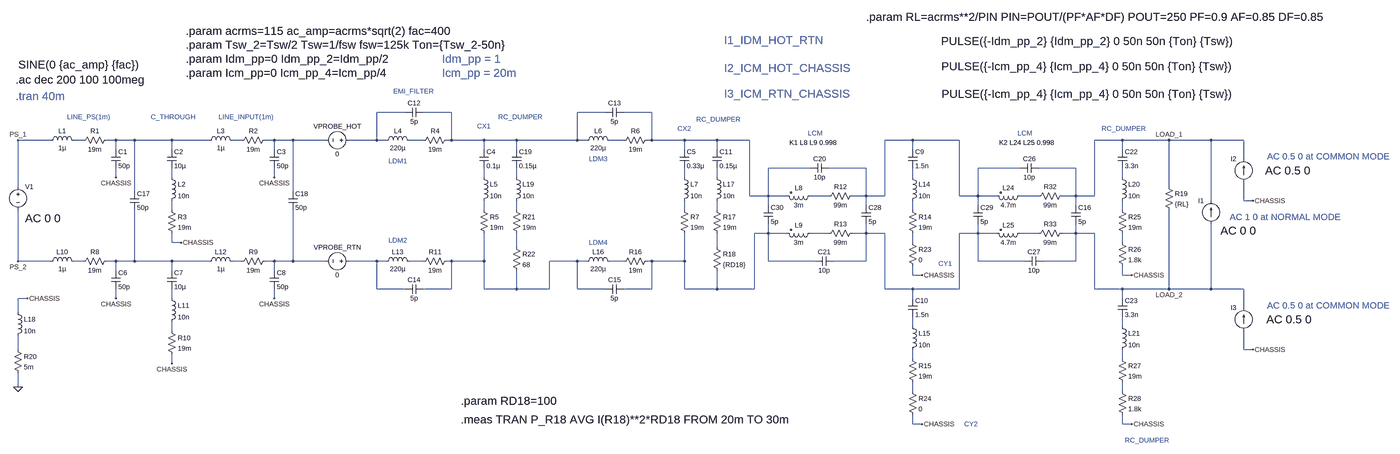
[diagram p0: schematic 461C_FILTER_20260719.asc, whole sheet]
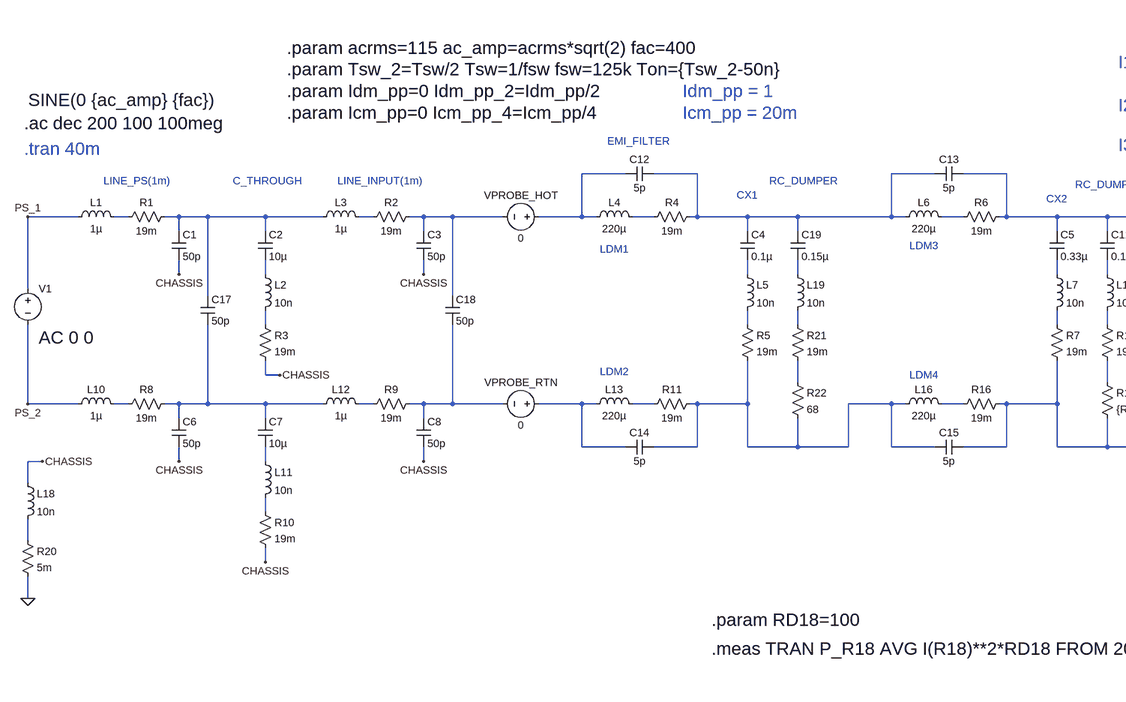
[diagram p1: schematic 461C_FILTER_20260719.asc, part, row 1 of 1, column 1 of 2]
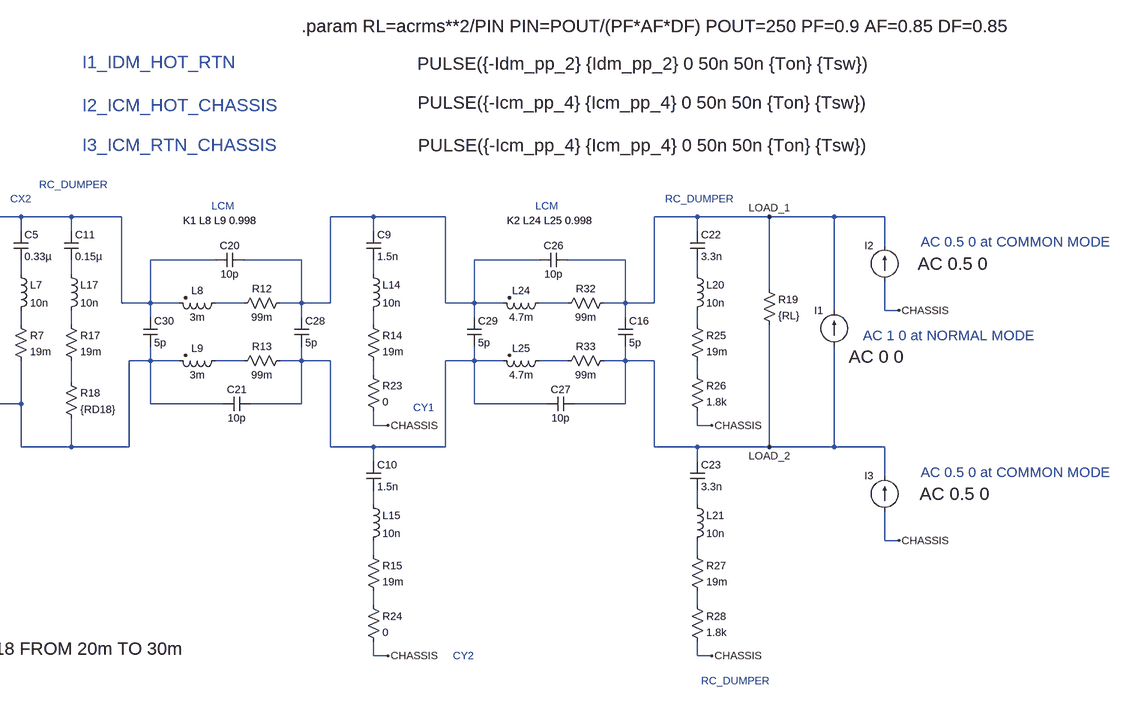
[diagram p2: schematic 461C_FILTER_20260719.asc, part, row 1 of 1, column 2 of 2]
461C_FILTER_20260719.asc, the LTspice schematic file:
Version 4.1
SHEET 1 4516 1364
WIRE 704 -48 608 -48
WIRE 864 -48 768 -48
WIRE 1392 -48 1296 -48
WIRE 1552 -48 1456 -48
WIRE -512 48 -624 48
WIRE -400 48 -432 48
WIRE -288 48 -320 48
WIRE -224 48 -288 48
WIRE -96 48 -224 48
WIRE 32 48 -96 48
WIRE 144 48 112 48
WIRE 256 48 224 48
WIRE 320 48 256 48
WIRE 432 48 320 48
WIRE 608 48 608 -48
WIRE 608 48 512 48
WIRE 640 48 608 48
WIRE 768 48 720 48
WIRE 864 48 864 -48
WIRE 864 48 848 48
WIRE 976 48 864 48
WIRE 1088 48 976 48
WIRE 1296 48 1296 -48
WIRE 1296 48 1088 48
WIRE 1328 48 1296 48
WIRE 1456 48 1408 48
WIRE 1552 48 1552 -48
WIRE 1552 48 1536 48
WIRE 1664 48 1552 48
WIRE 1776 48 1664 48
WIRE 1888 48 1776 48
WIRE 2448 48 2352 48
WIRE 2608 48 2448 48
WIRE 3168 48 3072 48
WIRE 3328 48 3168 48
WIRE 3472 48 3328 48
WIRE 3584 48 3472 48
WIRE -288 80 -288 48
WIRE -96 80 -96 48
WIRE 256 80 256 48
WIRE 976 80 976 48
WIRE 1088 80 1088 48
WIRE 1664 80 1664 48
WIRE 1776 80 1776 48
WIRE 2448 80 2448 48
WIRE 3168 80 3168 48
WIRE 3584 112 3584 48
WIRE 2096 144 1952 144
WIRE 2288 144 2160 144
WIRE 2816 144 2672 144
WIRE 3008 144 2880 144
WIRE -288 176 -288 144
WIRE -96 176 -96 144
WIRE 256 176 256 144
WIRE 976 176 976 144
WIRE 1088 176 1088 144
WIRE 1664 176 1664 144
WIRE 1776 176 1776 144
WIRE 2448 176 2448 144
WIRE 3168 176 3168 144
WIRE -624 208 -624 48
WIRE 3328 208 3328 48
WIRE -224 224 -224 48
WIRE 320 224 320 48
WIRE 1888 240 1888 48
WIRE 1952 240 1952 144
WIRE 1952 240 1888 240
WIRE 2016 240 1952 240
WIRE 2160 240 2096 240
WIRE 2288 240 2288 144
WIRE 2288 240 2240 240
WIRE 2352 240 2352 48
WIRE 2352 240 2288 240
WIRE 2608 240 2608 48
WIRE 2672 240 2672 144
WIRE 2672 240 2608 240
WIRE 2736 240 2672 240
WIRE 2880 240 2816 240
WIRE 3008 240 3008 144
WIRE 3008 240 2960 240
WIRE 3072 240 3072 48
WIRE 3072 240 3008 240
WIRE 3472 256 3472 48
WIRE 3584 256 3584 192
WIRE 3616 256 3584 256
WIRE 1952 272 1952 240
WIRE 2288 272 2288 240
WIRE 2672 272 2672 240
WIRE 3008 272 3008 240
WIRE -96 288 -96 256
WIRE 976 288 976 256
WIRE 1088 288 1088 256
WIRE 1664 288 1664 256
WIRE 1776 288 1776 256
WIRE 2448 288 2448 256
WIRE 3168 288 3168 256
WIRE 1952 368 1952 336
WIRE 1952 368 1904 368
WIRE 2016 368 1952 368
WIRE 2160 368 2096 368
WIRE 2288 368 2288 336
WIRE 2288 368 2240 368
WIRE 2352 368 2288 368
WIRE 2672 368 2672 336
WIRE 2672 368 2608 368
WIRE 2736 368 2672 368
WIRE 2880 368 2816 368
WIRE 3008 368 3008 336
WIRE 3008 368 2960 368
WIRE 3072 368 3008 368
WIRE -96 400 -96 368
WIRE -64 400 -96 400
WIRE 2448 400 2448 368
WIRE 3168 400 3168 368
WIRE 1088 416 1088 368
WIRE 1776 416 1776 368
WIRE -624 464 -624 288
WIRE -512 464 -624 464
WIRE -400 464 -432 464
WIRE -288 464 -320 464
WIRE -224 464 -224 288
WIRE -224 464 -288 464
WIRE -96 464 -224 464
WIRE 32 464 -96 464
WIRE 144 464 112 464
WIRE 256 464 224 464
WIRE 320 464 320 288
WIRE 320 464 256 464
WIRE 432 464 320 464
WIRE 608 464 512 464
WIRE 640 464 608 464
WIRE 768 464 720 464
WIRE 864 464 848 464
WIRE 976 464 976 368
WIRE 976 464 864 464
WIRE 1296 464 1200 464
WIRE 1328 464 1296 464
WIRE 1456 464 1408 464
WIRE 1552 464 1536 464
WIRE 1664 464 1664 368
WIRE 1664 464 1552 464
WIRE 1952 464 1952 368
WIRE 2112 464 1952 464
WIRE 2288 464 2288 368
WIRE 2288 464 2176 464
WIRE 2672 464 2672 368
WIRE 2832 464 2672 464
WIRE 3008 464 3008 368
WIRE 3008 464 2896 464
WIRE -288 496 -288 464
WIRE -96 496 -96 464
WIRE 256 496 256 464
WIRE 2448 512 2448 480
WIRE 2480 512 2448 512
WIRE 3168 512 3168 480
WIRE 3200 512 3168 512
WIRE 608 560 608 464
WIRE 704 560 608 560
WIRE 864 560 864 464
WIRE 864 560 768 560
WIRE 976 560 976 464
WIRE 1088 560 1088 496
WIRE 1088 560 976 560
WIRE 1200 560 1200 464
WIRE 1200 560 1088 560
WIRE 1296 560 1296 464
WIRE 1392 560 1296 560
WIRE 1552 560 1552 464
WIRE 1552 560 1456 560
WIRE 1664 560 1664 464
WIRE 1776 560 1776 496
WIRE 1776 560 1664 560
WIRE 1904 560 1904 368
WIRE 1904 560 1776 560
WIRE 2352 560 2352 368
WIRE 2448 560 2352 560
WIRE 2608 560 2608 368
WIRE 2608 560 2448 560
WIRE 3072 560 3072 368
WIRE 3168 560 3072 560
WIRE 3328 560 3328 288
WIRE 3328 560 3168 560
WIRE 3472 560 3472 336
WIRE 3472 560 3328 560
WIRE 3584 560 3472 560
WIRE -592 592 -624 592
WIRE -288 592 -288 560
WIRE -96 592 -96 560
WIRE 256 592 256 560
WIRE 2448 592 2448 560
WIRE 3168 592 3168 560
WIRE 3584 624 3584 560
WIRE -624 640 -624 592
WIRE 2448 688 2448 656
WIRE 3168 688 3168 656
WIRE -96 704 -96 672
WIRE -624 768 -624 720
WIRE 3584 768 3584 704
WIRE 3616 768 3584 768
WIRE 2448 800 2448 768
WIRE 3168 800 3168 768
WIRE -96 816 -96 784
WIRE -624 896 -624 848
WIRE 2448 912 2448 880
WIRE 3168 912 3168 880
WIRE 2448 1024 2448 992
WIRE 2480 1024 2448 1024
WIRE 3168 1024 3168 992
WIRE 3200 1024 3168 1024
FLAG 3328 48 LOAD_1
FLAG 3328 560 LOAD_2
FLAG -624 48 PS_1
FLAG -624 464 PS_2
FLAG -288 176 CHASSIS
FLAG -288 592 CHASSIS
FLAG -96 816 CHASSIS
FLAG 256 176 CHASSIS
FLAG 256 592 CHASSIS
FLAG -64 400 CHASSIS
FLAG 2480 512 CHASSIS
FLAG -624 896 0
FLAG -592 592 CHASSIS
FLAG 3616 256 CHASSIS
FLAG 3616 768 CHASSIS
FLAG 2480 1024 CHASSIS
FLAG 3200 512 CHASSIS
FLAG 3200 1024 CHASSIS
SYMBOL voltage -624 192 R0
WINDOW 123 24 124 Left 4
WINDOW 39 0 0 Left 0
WINDOW 3 1 -404 Left 4
SYMATTR Value2 AC 0 0
SYMATTR Value SINE(0 {ac_amp} {fac})
SYMATTR InstName V1
SYMBOL ind -528 64 R270
WINDOW 0 32 56 VTop 2
WINDOW 3 5 56 VBottom 2
SYMATTR InstName L1
SYMATTR Value 1µ
SYMATTR SpiceLine Rser=1m
SYMBOL res -304 32 R90
WINDOW 0 0 56 VBottom 2
WINDOW 3 32 56 VTop 2
SYMATTR InstName R1
SYMATTR Value 19m
SYMBOL cap -304 80 R0
SYMATTR InstName C1
SYMATTR Value 50p
SYMBOL cap -112 80 R0
SYMATTR InstName C2
SYMATTR Value 10µ
SYMBOL ind -112 160 R0
SYMATTR InstName L2
SYMATTR Value 10n
SYMATTR SpiceLine Rser=1m
SYMBOL ind 16 64 R270
WINDOW 0 32 56 VTop 2
WINDOW 3 5 56 VBottom 2
SYMATTR InstName L3
SYMATTR Value 1µ
SYMATTR SpiceLine Rser=1m
SYMBOL res 240 32 R90
WINDOW 0 0 56 VBottom 2
WINDOW 3 32 56 VTop 2
SYMATTR InstName R2
SYMATTR Value 19m
SYMBOL cap 240 80 R0
SYMATTR InstName C3
SYMATTR Value 50p
SYMBOL res -112 272 R0
SYMATTR InstName R3
SYMATTR Value 19m
SYMBOL ind 624 64 R270
WINDOW 0 32 56 VTop 2
WINDOW 3 5 56 VBottom 2
SYMATTR InstName L4
SYMATTR Value 220µ
SYMATTR SpiceLine Rser=1m
SYMBOL res 864 32 R90
WINDOW 0 0 56 VBottom 2
WINDOW 3 32 56 VTop 2
SYMATTR InstName R4
SYMATTR Value 19m
SYMBOL cap 960 80 R0
SYMATTR InstName C4
SYMATTR Value 0.1µ
SYMBOL ind 960 160 R0
SYMATTR InstName L5
SYMATTR Value 10n
SYMATTR SpiceLine Rser=1m
SYMBOL res 960 272 R0
SYMATTR InstName R5
SYMATTR Value 19m
SYMBOL ind 1312 64 R270
WINDOW 0 32 56 VTop 2
WINDOW 3 5 56 VBottom 2
SYMATTR InstName L6
SYMATTR Value 220µ
SYMATTR SpiceLine Rser=1m
SYMBOL res 1552 32 R90
WINDOW 0 0 56 VBottom 2
WINDOW 3 32 56 VTop 2
SYMATTR InstName R6
SYMATTR Value 19m
SYMBOL cap 1648 80 R0
SYMATTR InstName C5
SYMATTR Value 0.33µ
SYMBOL ind 1648 160 R0
SYMATTR InstName L7
SYMATTR Value 10n
SYMATTR SpiceLine Rser=1m
SYMBOL res 1648 272 R0
SYMATTR InstName R7
SYMATTR Value 19m
SYMBOL ind2 2112 224 R90
WINDOW 0 4 56 VBottom 2
WINDOW 3 32 56 VTop 2
SYMATTR InstName L8
SYMATTR Value 3m
SYMATTR SpiceLine Rser=1m
SYMBOL ind2 2112 352 R90
WINDOW 0 4 56 VBottom 2
WINDOW 3 32 56 VTop 2
SYMATTR InstName L9
SYMATTR Value 3m
SYMATTR SpiceLine Rser=1m
SYMBOL ind -528 480 R270
WINDOW 0 32 56 VTop 2
WINDOW 3 5 56 VBottom 2
SYMATTR InstName L10
SYMATTR Value 1µ
SYMATTR SpiceLine Rser=1m
SYMBOL res -304 448 R90
WINDOW 0 0 56 VBottom 2
WINDOW 3 32 56 VTop 2
SYMATTR InstName R8
SYMATTR Value 19m
SYMBOL cap -304 496 R0
SYMATTR InstName C6
SYMATTR Value 50p
SYMBOL cap -112 496 R0
SYMATTR InstName C7
SYMATTR Value 10µ
SYMBOL ind -112 576 R0
SYMATTR InstName L11
SYMATTR Value 10n
SYMATTR SpiceLine Rser=1m
SYMBOL ind 16 480 R270
WINDOW 0 32 56 VTop 2
WINDOW 3 5 56 VBottom 2
SYMATTR InstName L12
SYMATTR Value 1µ
SYMATTR SpiceLine Rser=1m
SYMBOL res 240 448 R90
WINDOW 0 0 56 VBottom 2
WINDOW 3 32 56 VTop 2
SYMATTR InstName R9
SYMATTR Value 19m
SYMBOL cap 240 496 R0
SYMATTR InstName C8
SYMATTR Value 50p
SYMBOL res -112 688 R0
SYMATTR InstName R10
SYMATTR Value 19m
SYMBOL ind 624 480 R270
WINDOW 0 32 56 VTop 2
WINDOW 3 5 56 VBottom 2
SYMATTR InstName L13
SYMATTR Value 220µ
SYMATTR SpiceLine Rser=1m
SYMBOL res 864 448 R90
WINDOW 0 0 56 VBottom 2
WINDOW 3 32 56 VTop 2
SYMATTR InstName R11
SYMATTR Value 19m
SYMBOL res 2256 224 R90
WINDOW 0 0 56 VBottom 2
WINDOW 3 32 56 VTop 2
SYMATTR InstName R12
SYMATTR Value 99m
SYMBOL res 2256 352 R90
WINDOW 0 0 56 VBottom 2
WINDOW 3 32 56 VTop 2
SYMATTR InstName R13
SYMATTR Value 99m
SYMBOL cap 2432 80 R0
SYMATTR InstName C9
SYMATTR Value 1.5n
SYMBOL ind 2432 160 R0
SYMATTR InstName L14
SYMATTR Value 10n
SYMATTR SpiceLine Rser=1m
SYMBOL res 2432 272 R0
SYMATTR InstName R14
SYMATTR Value 19m
SYMBOL cap 2432 592 R0
SYMATTR InstName C10
SYMATTR Value 1.5n
SYMBOL ind 2432 672 R0
SYMATTR InstName L15
SYMATTR Value 10n
SYMATTR SpiceLine Rser=1m
SYMBOL res 2432 784 R0
SYMATTR InstName R15
SYMATTR Value 19m
SYMBOL ind 1312 480 R270
WINDOW 0 32 56 VTop 2
WINDOW 3 5 56 VBottom 2
SYMATTR InstName L16
SYMATTR Value 220µ
SYMATTR SpiceLine Rser=1m
SYMBOL res 1552 448 R90
WINDOW 0 0 56 VBottom 2
WINDOW 3 32 56 VTop 2
SYMATTR InstName R16
SYMATTR Value 19m
SYMBOL cap 1760 80 R0
SYMATTR InstName C11
SYMATTR Value 0.15µ
SYMBOL ind 1760 160 R0
SYMATTR InstName L17
SYMATTR Value 10n
SYMATTR SpiceLine Rser=1m
SYMBOL res 1760 272 R0
SYMATTR InstName R17
SYMATTR Value 19m
SYMBOL res 1760 400 R0
SYMATTR InstName R18
SYMATTR Value {RD18}
SYMBOL res 3312 192 R0
SYMATTR InstName R19
SYMATTR Value {RL}
SYMBOL cap 768 -64 R90
WINDOW 0 0 32 VBottom 2
WINDOW 3 32 32 VTop 2
SYMATTR InstName C12
SYMATTR Value 5p
SYMBOL cap 1456 -64 R90
WINDOW 0 0 32 VBottom 2
WINDOW 3 32 32 VTop 2
SYMATTR InstName C13
SYMATTR Value 5p
SYMBOL cap 768 544 R90
WINDOW 0 0 32 VBottom 2
WINDOW 3 32 32 VTop 2
SYMATTR InstName C14
SYMATTR Value 5p
SYMBOL cap 1456 544 R90
WINDOW 0 0 32 VBottom 2
WINDOW 3 32 32 VTop 2
SYMATTR InstName C15
SYMATTR Value 5p
SYMBOL cap 2992 272 R0
SYMATTR InstName C16
SYMATTR Value 5p
SYMBOL cap -240 224 R0
SYMATTR InstName C17
SYMATTR Value 50p
SYMBOL cap 304 224 R0
SYMATTR InstName C18
SYMATTR Value 50p
SYMBOL ind -640 624 R0
SYMATTR InstName L18
SYMATTR Value 10n
SYMATTR SpiceLine Rser=1m
SYMBOL res -640 752 R0
SYMATTR InstName R20
SYMATTR Value 5m
SYMBOL cap 1072 80 R0
SYMATTR InstName C19
SYMATTR Value 0.15µ
SYMBOL ind 1072 160 R0
SYMATTR InstName L19
SYMATTR Value 10n
SYMATTR SpiceLine Rser=1m
SYMBOL res 1072 272 R0
SYMATTR InstName R21
SYMATTR Value 19m
SYMBOL res 1072 400 R0
SYMATTR InstName R22
SYMATTR Value 68
SYMBOL voltage 528 48 R90
WINDOW 0 -32 56 VBottom 2
WINDOW 3 32 56 VTop 2
WINDOW 123 0 0 Left 0
WINDOW 39 0 0 Left 0
SYMATTR InstName VPROBE_HOT
SYMATTR Value 0
SYMBOL voltage 528 464 R90
WINDOW 0 -32 56 VBottom 2
WINDOW 3 32 56 VTop 2
WINDOW 123 0 0 Left 0
WINDOW 39 0 0 Left 0
SYMATTR InstName VPROBE_RTN
SYMATTR Value 0
SYMBOL current 3472 336 R180
WINDOW 0 24 80 Left 2
WINDOW 3 -83 629 Left 4
WINDOW 123 -155 -23 Left 4
WINDOW 39 0 0 Left 0
SYMATTR InstName I1
SYMATTR Value PULSE({-Idm_pp_2} {Idm_pp_2} 0 50n 50n {Ton} {Tsw})
SYMATTR Value2 AC 0 0
SYMBOL current 3584 192 R180
WINDOW 0 24 80 Left 2
WINDOW 3 33 398 Left 4
WINDOW 123 -230 40 Left 4
WINDOW 39 0 0 Left 0
SYMATTR InstName I2
SYMATTR Value PULSE({-Icm_pp_4} {Icm_pp_4} 0 50n 50n {Ton} {Tsw})
SYMATTR Value2 AC 0.5 0
SYMBOL current 3584 704 R180
WINDOW 0 24 80 Left 2
WINDOW 3 32 815 Left 4
WINDOW 123 -234 40 Left 4
WINDOW 39 0 0 Left 0
SYMATTR InstName I3
SYMATTR Value PULSE({-Icm_pp_4} {Icm_pp_4} 0 50n 50n {Ton} {Tsw})
SYMATTR Value2 AC 0.5 0
SYMBOL cap 2160 128 R90
WINDOW 0 0 32 VBottom 2
WINDOW 3 32 32 VTop 2
SYMATTR InstName C20
SYMATTR Value 10p
SYMBOL cap 2176 448 R90
WINDOW 0 0 32 VBottom 2
WINDOW 3 32 32 VTop 2
SYMATTR InstName C21
SYMATTR Value 10p
SYMBOL res 2432 384 R0
SYMATTR InstName R23
SYMATTR Value 0
SYMBOL res 2432 896 R0
SYMATTR InstName R24
SYMATTR Value 0
SYMBOL cap 3152 80 R0
SYMATTR InstName C22
SYMATTR Value 3.3n
SYMBOL ind 3152 160 R0
SYMATTR InstName L20
SYMATTR Value 10n
SYMATTR SpiceLine Rser=1m
SYMBOL res 3152 272 R0
SYMATTR InstName R25
SYMATTR Value 19m
SYMBOL res 3152 384 R0
SYMATTR InstName R26
SYMATTR Value 1.8k
SYMBOL cap 3152 592 R0
SYMATTR InstName C23
SYMATTR Value 3.3n
SYMBOL ind 3152 672 R0
SYMATTR InstName L21
SYMATTR Value 10n
SYMATTR SpiceLine Rser=1m
SYMBOL res 3152 784 R0
SYMATTR InstName R27
SYMATTR Value 19m
SYMBOL res 3152 896 R0
SYMATTR InstName R28
SYMATTR Value 1.8k
SYMBOL ind2 2832 224 R90
WINDOW 0 4 56 VBottom 2
WINDOW 3 32 56 VTop 2
SYMATTR InstName L24
SYMATTR Value 4.7m
SYMATTR SpiceLine Rser=1m
SYMBOL ind2 2832 352 R90
WINDOW 0 4 56 VBottom 2
WINDOW 3 32 56 VTop 2
SYMATTR InstName L25
SYMATTR Value 4.7m
SYMATTR SpiceLine Rser=1m
SYMBOL res 2976 224 R90
WINDOW 0 0 56 VBottom 2
WINDOW 3 32 56 VTop 2
SYMATTR InstName R32
SYMATTR Value 99m
SYMBOL res 2976 352 R90
WINDOW 0 0 56 VBottom 2
WINDOW 3 32 56 VTop 2
SYMATTR InstName R33
SYMATTR Value 99m
SYMBOL cap 2880 128 R90
WINDOW 0 0 32 VBottom 2
WINDOW 3 32 32 VTop 2
SYMATTR InstName C26
SYMATTR Value 10p
SYMBOL cap 2896 448 R90
WINDOW 0 0 32 VBottom 2
WINDOW 3 32 32 VTop 2
SYMATTR InstName C27
SYMATTR Value 10p
SYMBOL cap 2272 272 R0
SYMATTR InstName C28
SYMATTR Value 5p
SYMBOL cap 2656 272 R0
SYMATTR InstName C29
SYMATTR Value 5p
SYMBOL cap 1936 272 R0
SYMATTR InstName C30
SYMATTR Value 5p
TEXT -456 -32 Left 2 ;LINE_PS(1m)
TEXT -168 -32 Left 2 ;C_THROUGH
TEXT 64 -32 Left 2 ;LINE_INPUT(1m)
TEXT 2024 56 Left 2 !K1 L8 L9 0.998
TEXT 952 0 Left 2 ;CX1
TEXT 1640 8 Left 2 ;CX2
TEXT 2536 472 Left 2 ;CY1
TEXT 2624 1024 Left 2 ;CY2
TEXT 2088 24 Left 2 ;LCM
TEXT 648 120 Left 2 ;LDM1
TEXT 648 392 Left 2 ;LDM2
TEXT 1336 112 Left 2 ;LDM3
TEXT 1336 400 Left 2 ;LDM4
TEXT 1704 -24 Left 2 ;RC_DUMPER
TEXT -632 -104 Left 4 ;.tran 40m
TEXT -48 -328 Left 4 !.param acrms=115 ac_amp=acrms*sqrt(2) fac=400
TEXT -632 -160 Left 4 !.ac dec 200 100 100meg
TEXT 664 -120 Left 2 ;EMI_FILTER
TEXT -48 -232 Left 4 !.param Idm_pp=0 Idm_pp_2=Idm_pp/2
TEXT -48 -280 Left 4 !.param Tsw_2=Tsw/2 Tsw=1/fsw fsw=125k Ton={Tsw_2-50n}
TEXT -48 -184 Left 4 !.param Icm_pp=0 Icm_pp_4=Icm_pp/4
TEXT 1800 -296 Left 4 ;I1_IDM_HOT_RTN
TEXT 1800 -200 Left 4 ;I2_ICM_HOT_CHASSIS
TEXT 1800 -112 Left 4 ;I3_ICM_RTN_CHASSIS
TEXT 3664 104 Left 3 ;AC 0.5 0 at COMMON MODE
TEXT 3664 616 Left 3 ;AC 0.5 0 at COMMON MODE
TEXT 3536 312 Left 3 ;AC 1 0 at NORMAL MODE
TEXT 1024 -32 Left 2 ;RC_DUMPER
TEXT 3176 1080 Left 2 ;RC_DUMPER
TEXT 3096 8 Left 2 ;RC_DUMPER
TEXT 896 1008 Left 4 !.meas TRAN P_R18 AVG I(R18)**2*RD18 FROM 20m TO 30m
TEXT 832 -232 Left 4 ;Idm_pp = 1
TEXT 832 -184 Left 4 ;Icm_pp = 20m
TEXT 2288 -376 Left 4 !.param RL=acrms**2/PIN PIN=POUT/(PF*AF*DF) POUT=250 PF=0.9 AF=0.85 DF=0.85
TEXT 2744 56 Left 2 !K2 L24 L25 0.998
TEXT 2808 24 Left 2 ;LCM
TEXT 896 944 Left 4 !.param RD18=100

The netlist it stands for:
* 461C_FILTER_20260719.asc
V1 PS_1 PS_2 SINE(0 {ac_amp} {fac}) AC 0 0
L1 PS_1 N004 1µ Rser=1m
R1 N005 N004 19m
C1 N005 CHASSIS 50p
C2 N005 N011 10µ
L2 N011 N020 10n Rser=1m
L3 N005 N006 1µ Rser=1m
R2 N007 N006 19m
C3 N007 CHASSIS 50p
R3 N020 CHASSIS 19m
L4 N001 N008 220µ Rser=1m
R4 N002 N008 19m
C4 N002 N012 0.1µ
L5 N012 N021 10n Rser=1m
R5 N021 N041 19m
L6 N002 N009 220µ Rser=1m
R6 N003 N009 19m
C5 N003 N014 0.33µ
L7 N014 N023 10n Rser=1m
R7 N023 N027 19m
L8 N018 N003 3m Rser=1m
L9 N028 N027 3m Rser=1m
L10 PS_2 N035 1µ Rser=1m
R8 N036 N035 19m
C6 N036 CHASSIS 50p
C7 N036 N043 10µ
L11 N043 N046 10n Rser=1m
L12 N036 N037 1µ Rser=1m
R9 N038 N037 19m
C8 N038 CHASSIS 50p
R10 N046 CHASSIS 19m
L13 N039 N040 220µ Rser=1m
R11 N041 N040 19m
R12 N010 N018 99m
R13 N029 N028 99m
C9 N010 N016 1.5n
L14 N016 N025 10n Rser=1m
R14 N025 N031 19m
C10 N029 N044 1.5n
L15 N044 N048 10n Rser=1m
R15 N048 N050 19m
L16 N041 N042 220µ Rser=1m
R16 N027 N042 19m
C11 N003 N015 0.15µ
L17 N015 N024 10n Rser=1m
R17 N024 N034 19m
R18 N034 N027 {RD18}
R19 LOAD_1 LOAD_2 {RL}
C12 N002 N001 5p
C13 N003 N002 5p
C14 N041 N039 5p
C15 N027 N041 5p
C16 LOAD_1 LOAD_2 5p
C17 N005 N036 50p
C18 N007 N038 50p
L18 CHASSIS N047 10n Rser=1m
R20 N047 0 5m
C19 N002 N013 0.15µ
L19 N013 N022 10n Rser=1m
R21 N022 N033 19m
R22 N033 N041 68
VPROBE_HOT N001 N007 0
VPROBE_RTN N039 N038 0
I1 LOAD_2 LOAD_1 PULSE({-Idm_pp_2} {Idm_pp_2} 0 50n 50n {Ton} {Tsw}) AC 0 0
I2 CHASSIS LOAD_1 PULSE({-Icm_pp_4} {Icm_pp_4} 0 50n 50n {Ton} {Tsw}) AC 0.5 0
I3 CHASSIS LOAD_2 PULSE({-Icm_pp_4} {Icm_pp_4} 0 50n 50n {Ton} {Tsw}) AC 0.5 0
C20 N010 N003 10p
C21 N029 N027 10p
R23 N031 CHASSIS 0
R24 N050 CHASSIS 0
C22 LOAD_1 N017 3.3n
L20 N017 N026 10n Rser=1m
R25 N026 N032 19m
R26 N032 CHASSIS 1.8k
C23 LOAD_2 N045 3.3n
L21 N045 N049 10n Rser=1m
R27 N049 N051 19m
R28 N051 CHASSIS 1.8k
L24 N019 N010 4.7m Rser=1m
L25 N030 N029 4.7m Rser=1m
R32 LOAD_1 N019 99m
R33 LOAD_2 N030 99m
C26 LOAD_1 N010 10p
C27 LOAD_2 N029 10p
C28 N010 N029 5p
C29 N010 N029 5p
C30 N003 N027 5p
* LINE_PS(1m)
* C_THROUGH
* LINE_INPUT(1m)
K1 L8 L9 0.998
* CX1
* CX2
* CY1
* CY2
* LCM
* LDM1
* LDM2
* LDM3
* LDM4
* RC_DUMPER
* .tran 40m
.param acrms=115 ac_amp=acrms*sqrt(2) fac=400
.ac dec 200 100 100meg
* EMI_FILTER
.param Idm_pp=0 Idm_pp_2=Idm_pp/2
.param Tsw_2=Tsw/2 Tsw=1/fsw fsw=125k Ton={Tsw_2-50n}
.param Icm_pp=0 Icm_pp_4=Icm_pp/4
* I1_IDM_HOT_RTN
* I2_ICM_HOT_CHASSIS
* I3_ICM_RTN_CHASSIS
* AC 0.5 0 at COMMON MODE
* AC 0.5 0 at COMMON MODE
* AC 1 0 at NORMAL MODE
* RC_DUMPER
* RC_DUMPER
* RC_DUMPER
.meas TRAN P_R18 AVG I(R18)**2*RD18 FROM 20m TO 30m
* Idm_pp = 1
* Icm_pp = 20m
.param RL=acrms**2/PIN PIN=POUT/(PF*AF*DF) POUT=250 PF=0.9 AF=0.85 DF=0.85
K2 L24 L25 0.998
* LCM
.param RD18=100
.backanno
.end